# Altium schematic sheet CPNSchematic.SchDoc
size A
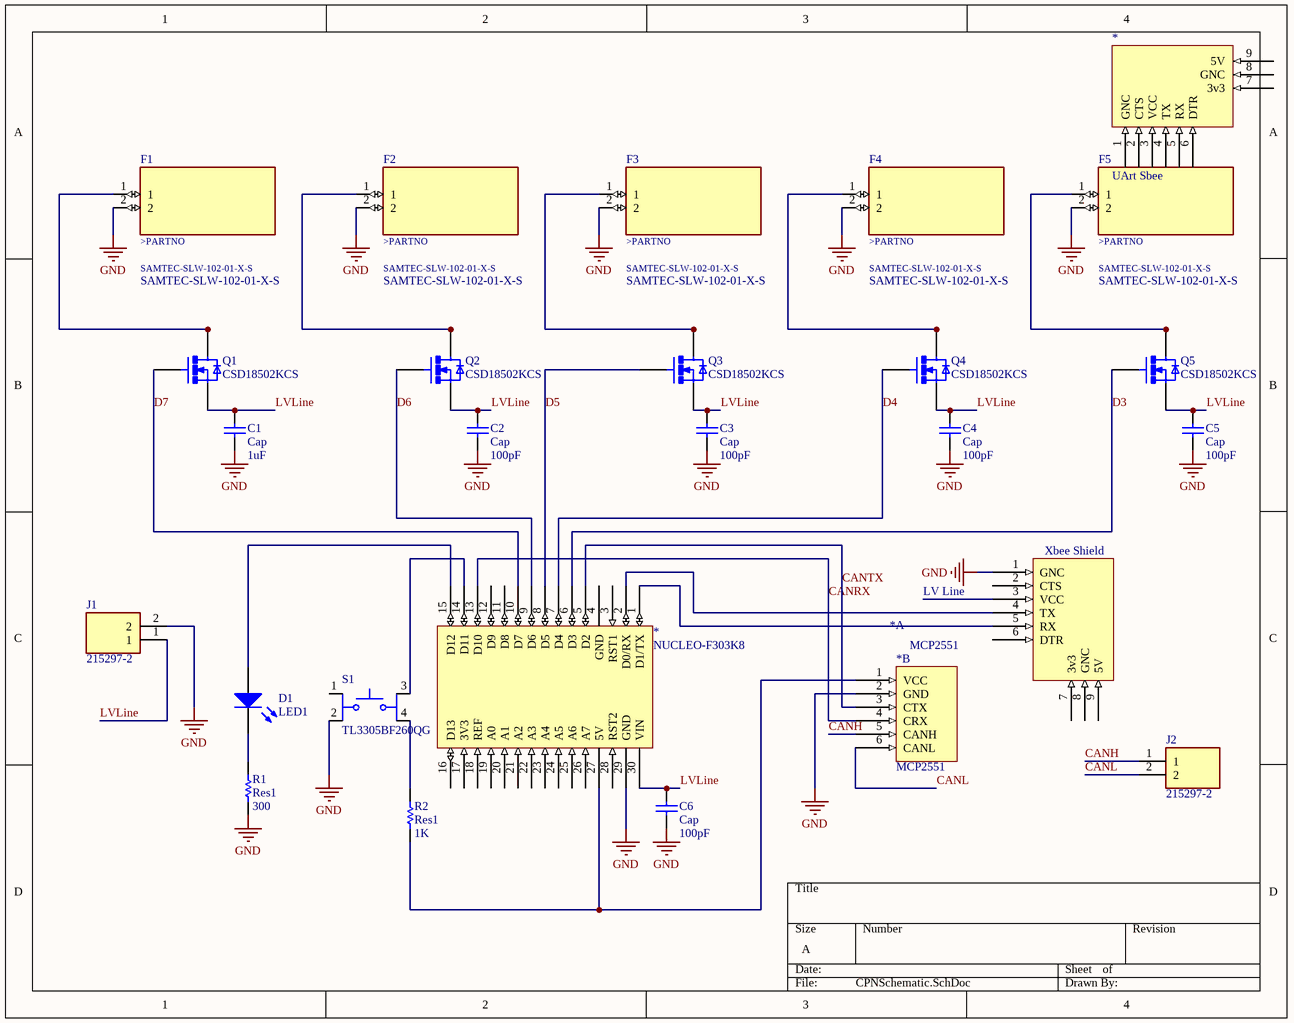
[diagram p0: CPNSchematic.SchDoc]

## Parts
(Parts that share a designator on the sheet are numbered #1, #2 ... from top to bottom, then left to right.)
*#1  UArt Sbee
*#2  NUCLEO-F303K8  [NUCLEO-F303K8-Footprint-1]
*#3  MCP2551  [MCP2551-Footprint-1]  (part A of 2)
*#4  MCP2551  [MCP2551-Footprint-1]  (part B of 2)
?  Xbee Shield
C1  Cap  value 1uF  [RAD-0.3]
C2  Cap  value 100pF  [RAD-0.3]
C3  Cap  value 100pF  [RAD-0.3]
C4  Cap  value 100pF  [RAD-0.3]
C5  Cap  value 100pF  [RAD-0.3]
C6  Cap  value 100pF  [RAD-0.3]
D1  LED1  [LED-1]
F1  SAMTEC-SLW-102-01-X-S  [SAMTEC-SLW-102-01-X-S]
F2  SAMTEC-SLW-102-01-X-S  [SAMTEC-SLW-102-01-X-S]
F3  SAMTEC-SLW-102-01-X-S  [SAMTEC-SLW-102-01-X-S]
F4  SAMTEC-SLW-102-01-X-S  [SAMTEC-SLW-102-01-X-S]
F5  SAMTEC-SLW-102-01-X-S  [SAMTEC-SLW-102-01-X-S]
J1  215297-2  [TE_215297-2]
J2  215297-2  [TE_215297-2]
Q1  CSD18502KCS  [TO254P1651X1067X470-3]
Q2  CSD18502KCS  [TO254P1651X1067X470-3]
Q3  CSD18502KCS  [TO254P1651X1067X470-3]
Q4  CSD18502KCS  [TO254P1651X1067X470-3]
Q5  CSD18502KCS  [TO254P1651X1067X470-3]
R1  Res1  value 300  [AXIAL-0.3]
R2  Res1  value 1K  [AXIAL-0.3]
S1  TL3305BF260QG  [SW_TL3305BF260QG]

## Nets
GND: *#2.29(GND) *#4.2(GND) ?.1(GNC) C1.1 C2.1 C3.1 C4.1 C5.1 C6.1 F1.2 F2.2 F3.2 F4.2 F5.2 J1.2 R1.1 S1.2
CANH: *#4.5(CANH) J2.1
CANL: *#4.6(CANL) J2.2
CANRX: *#2.13(D10) *#4.4(CRX)
CANTX: *#2.5(D2) *#4.3(CTX)
D3: *#2.6(D3) Q5.1(GATE)
D4: *#2.7(D4) Q4.1(GATE)
D5: *#2.8(D5) Q3.1(GATE)
D6: *#2.9(D6) Q2.1(GATE)
D7: *#2.10(D7) Q1.1(GATE)
LVLine: *#2.30(VIN) C1.2 C2.2 C3.2 C4.2 C5.2 C6.2 J1.1 Q1.3(SOURCE) Q2.3(SOURCE) Q3.3(SOURCE) Q4.3(SOURCE) Q5.3(SOURCE)
Net*#2_1: *#2.1(D1/TX) ?.5(RX)
Net*#2_2: *#2.2(D0/RX) ?.4(TX)
Net*#2_14: *#2.14(D11) S1.3
Net*#2_15: *#2.15(D12) D1.1(A)
Net*#2_27: *#2.27(5V) *#4.1(VCC) R2.1
NetD1_2: D1.2(K) R1.2
NetF1_1: F1.1 Q1.2(DRAIN) Q1.4(DRAIN) Q1.4.1(DRAIN)
NetF2_1: F2.1 Q2.2(DRAIN) Q2.4(DRAIN) Q2.4.1(DRAIN)
NetF3_1: F3.1 Q3.2(DRAIN) Q3.4(DRAIN) Q3.4.1(DRAIN)
NetF4_1: F4.1 Q4.2(DRAIN) Q4.4(DRAIN) Q4.4.1(DRAIN)
NetF5_1: F5.1 Q5.2(DRAIN) Q5.4(DRAIN) Q5.4.1(DRAIN)
NetR2_2: R2.2 S1.4

Not connected (* = marked no-connect by the designer): *#1 1(GNC) 2(CTS) 3(VCC) 4(TX) 5(RX) 6(DTR) 7(3v3) 8(GNC) 9(5V); *#2 3(RST1) 4(GND) 11(D8) 12(D9) 16(D13) 17(3V3) 18(REF) 19(A0) 20(A1) 21(A2) 22(A3) 23(A4) 24(A5) 25(A6) 26(A7) 28(RST2); ? 2(CTS) 3(VCC) 6(DTR) 7(3v3) 8(GNC) 9(5V); S1 1

## Notes on the sheet
- (near *#3) LV Line
- (in symbol SAMTEC-SLW-102-01-X-S) >PARTNO

## Library data of the parts
*#1 ? = CMP-00000-1
*#2 = nucleof303k8-1: Boards/Accessories
*#3 *#4 = MCP2551-1
C1-C6 = Cap: Capacitor; Published: 8-Jun-2000; LatestRevisionDate: 17-Jul-2002; LatestRevisionNote: Re-released for DXP Platform.; PackageReference: RAD-0.3; Publisher: Altium Limited; PackageDescription: Radial Cap, Thru-Hole; 2 Leads; 0.3 in Pin Spacing
D1 = LED1: Typical RED GaAs LED; Published: 8-Jun-2000; LatestRevisionDate: 08-Jul-2005; LatestRevisionNote: Mech Layer 1 removed.; PackageReference: LED-1; Publisher: Altium Limited; PackageDescription: LED; 2 Leads
F1-F5 = SAMTEC-SLW-102-01-X-S: MF: {'manufacturer': u'Samtec Inc.'}; Package: None; Price: None; Value: *; MP: SAMTEC-SLW-102-01-X-S; Availability: Unavailable
J1 J2 = 215297-2: MF: {'manufacturer': u'TE Connectivity'}; Package: None; Price: None; Value: *; MP: 215297-2; Availability: Unavailable
Q1-Q5 = CSD18502KCS: 40-V, N-Channel NexFET Power MOSFETs 3-TO-220 -55 to 150; MF: {'manufacturer': u'Texas Instruments'}; Package: None; Price: None; Value: *; MP: CSD18502KCS; Availability: Unavailable
R1 R2 = Res1: Resistor; Published: 8-Jun-2000; LatestRevisionDate: 17-Jul-2002; LatestRevisionNote: Re-released for DXP Platform.; PackageReference: AXIAL-0.3; Publisher: Altium Limited; PackageDescription: Axial Device, Thru-Hole; 2 Leads; 0.3 in Pin Spacing
S1 = TL3305BF260QG: MF: {'manufacturer': u'E-Switch'}; Package: None; Price: None; Value: *; MP: TL3305BF260QG; Availability: Unavailable